# EAGLE board oresat-proto-card (EAGLE 9.6.2), part 1 of 2
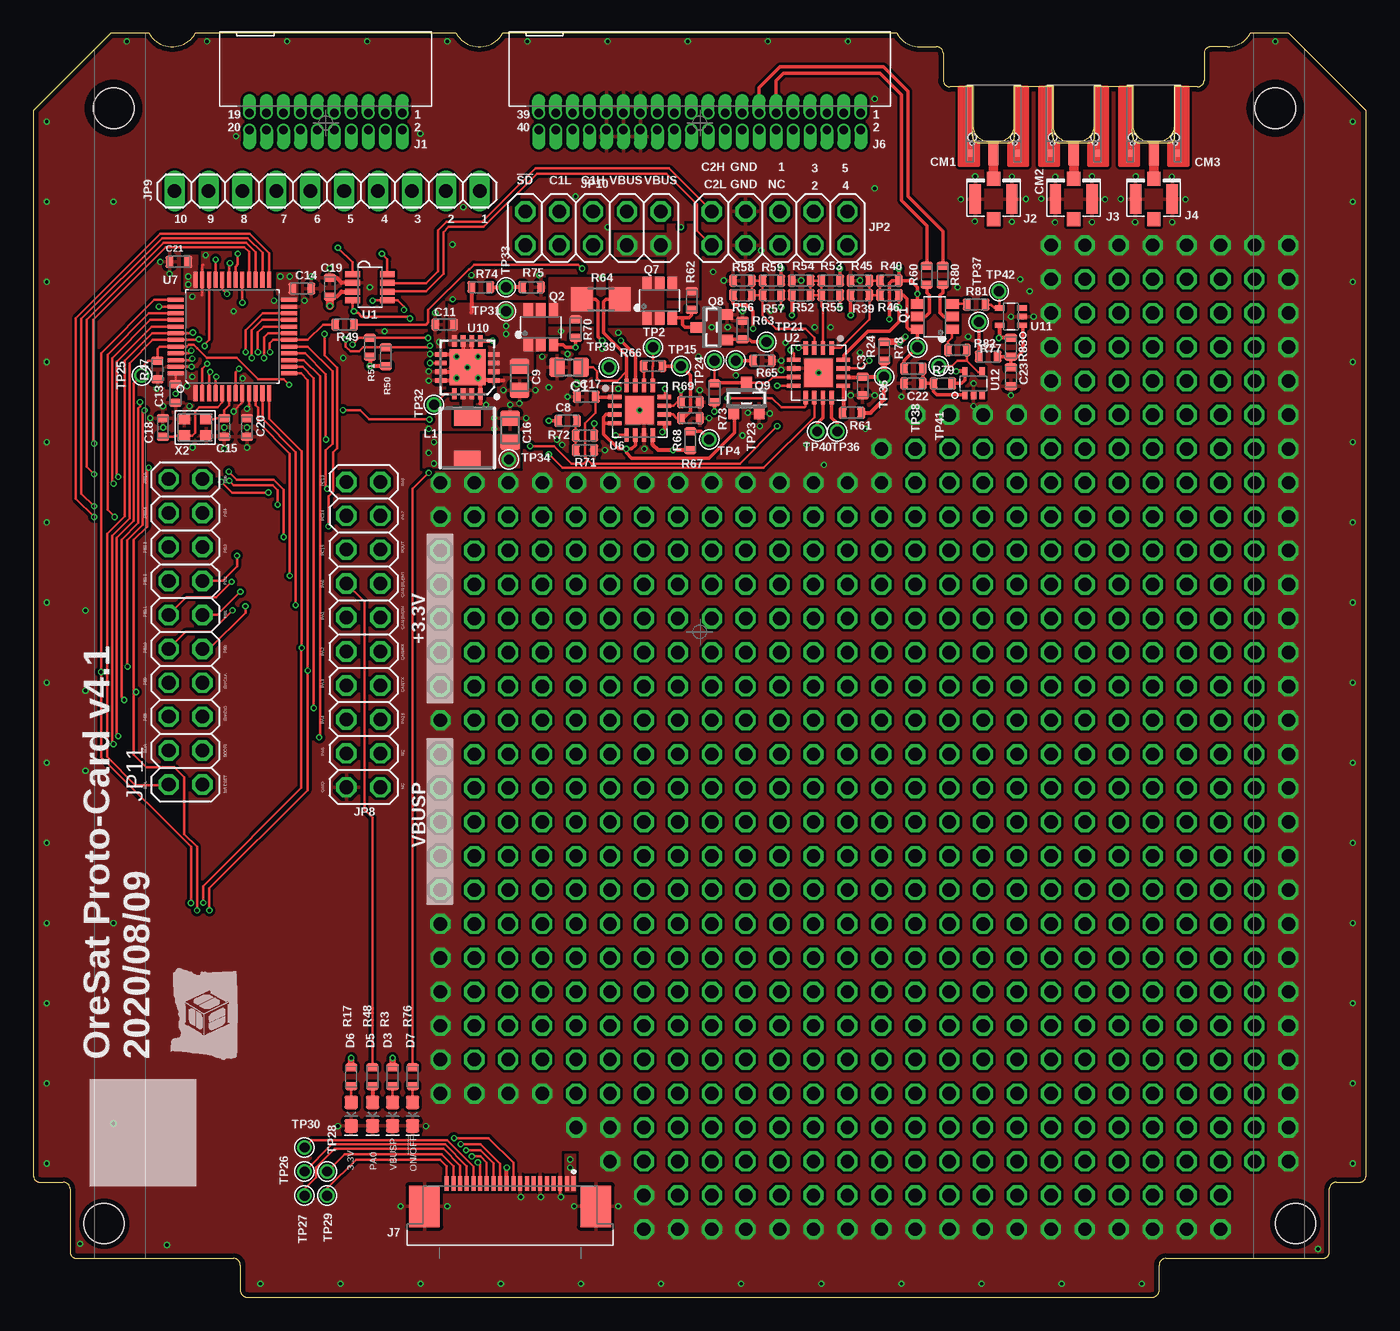
[diagram p3: board, top side]
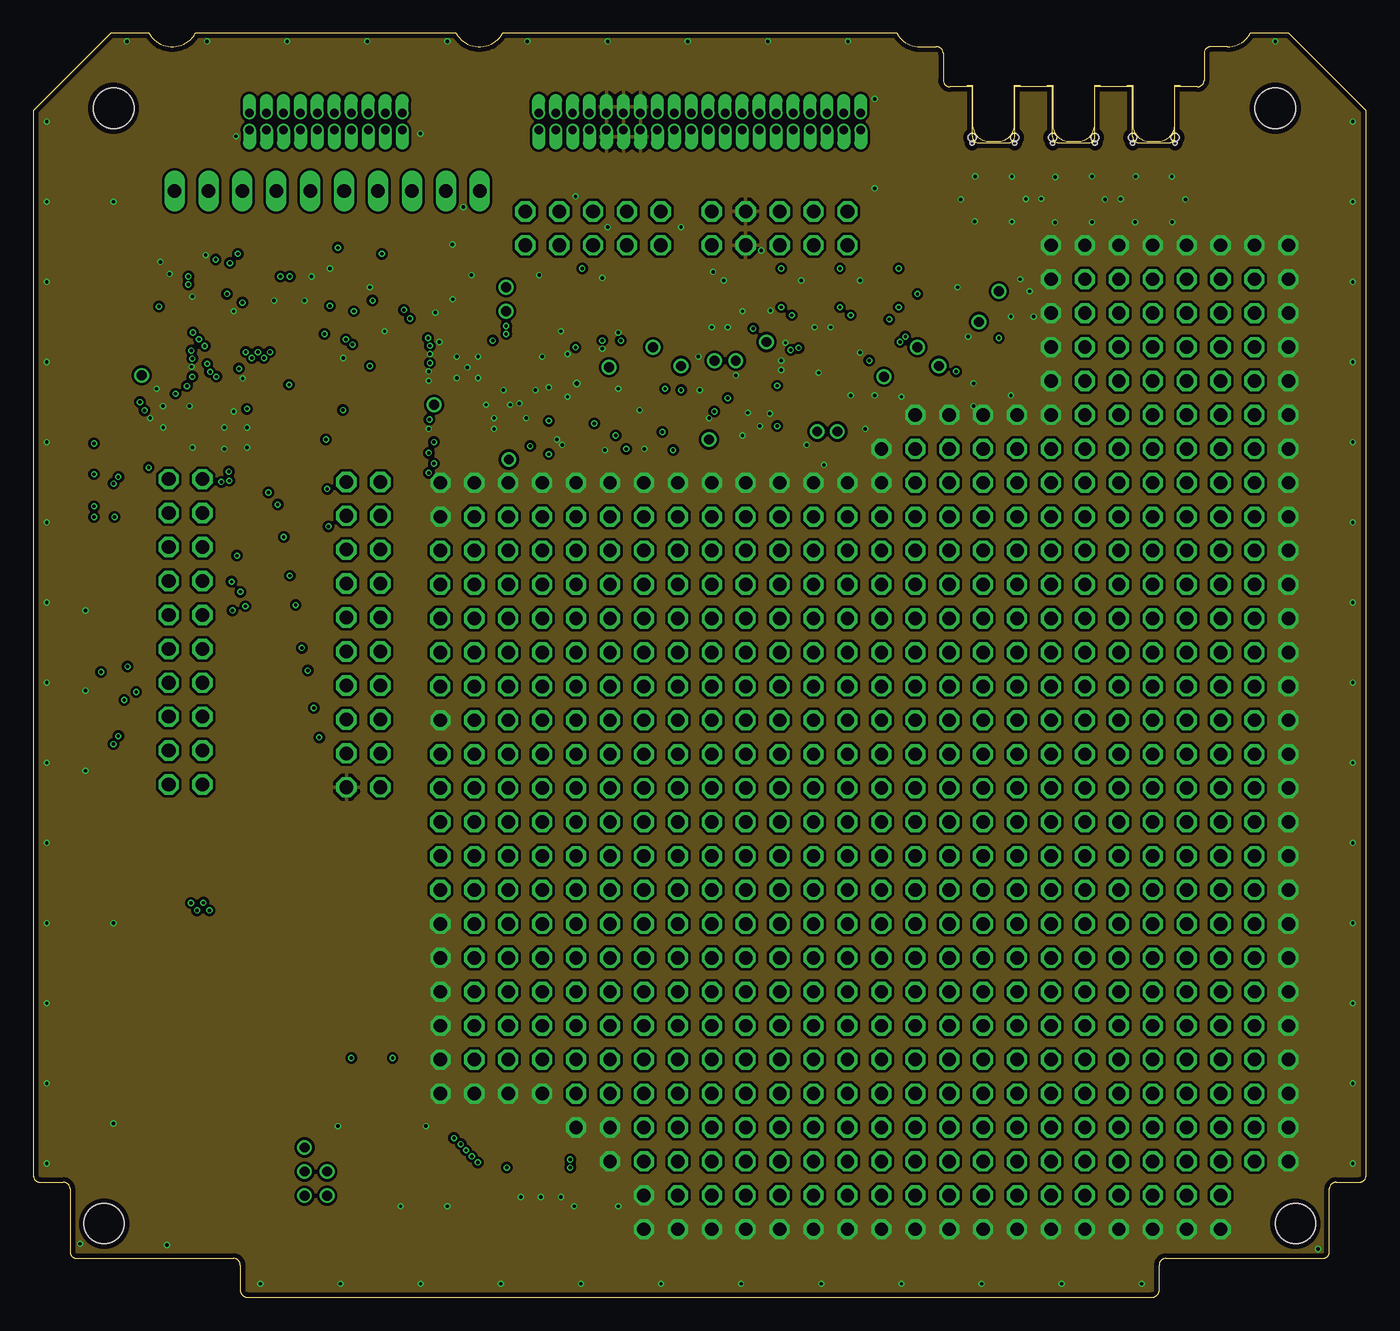
[diagram p4: board, inner layer Route2]
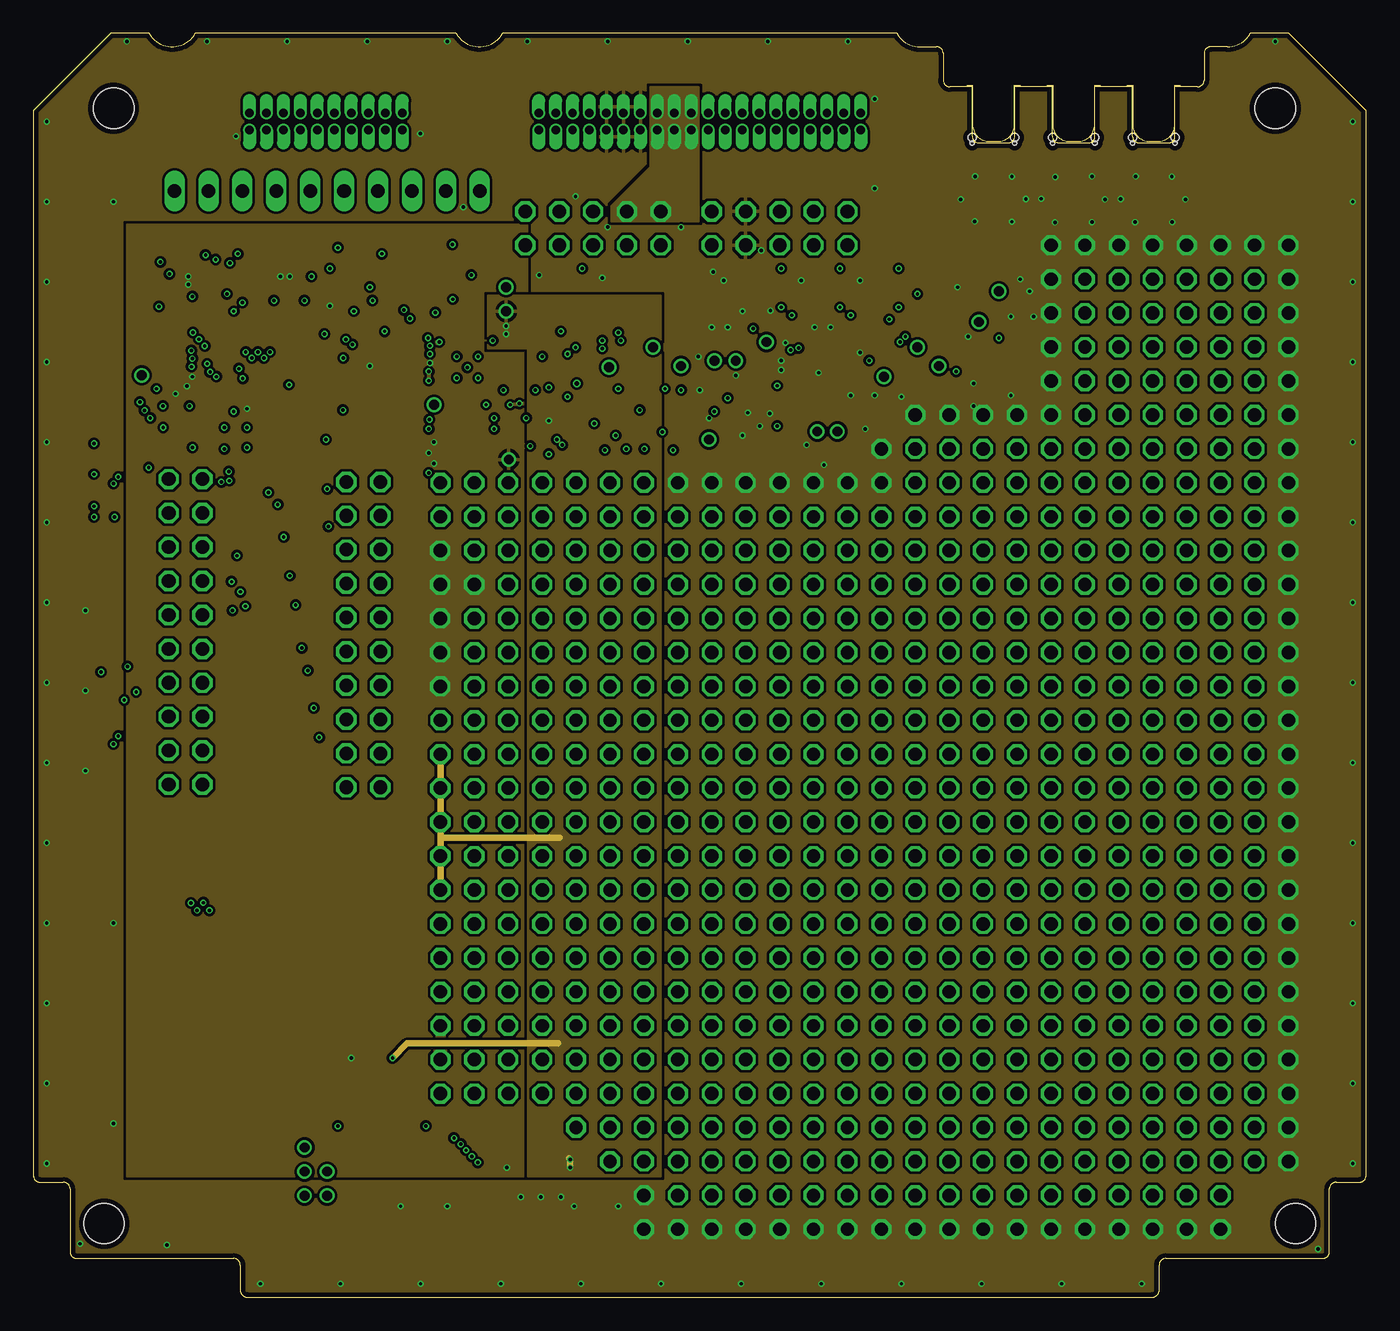
[diagram p5: board, inner layer route]
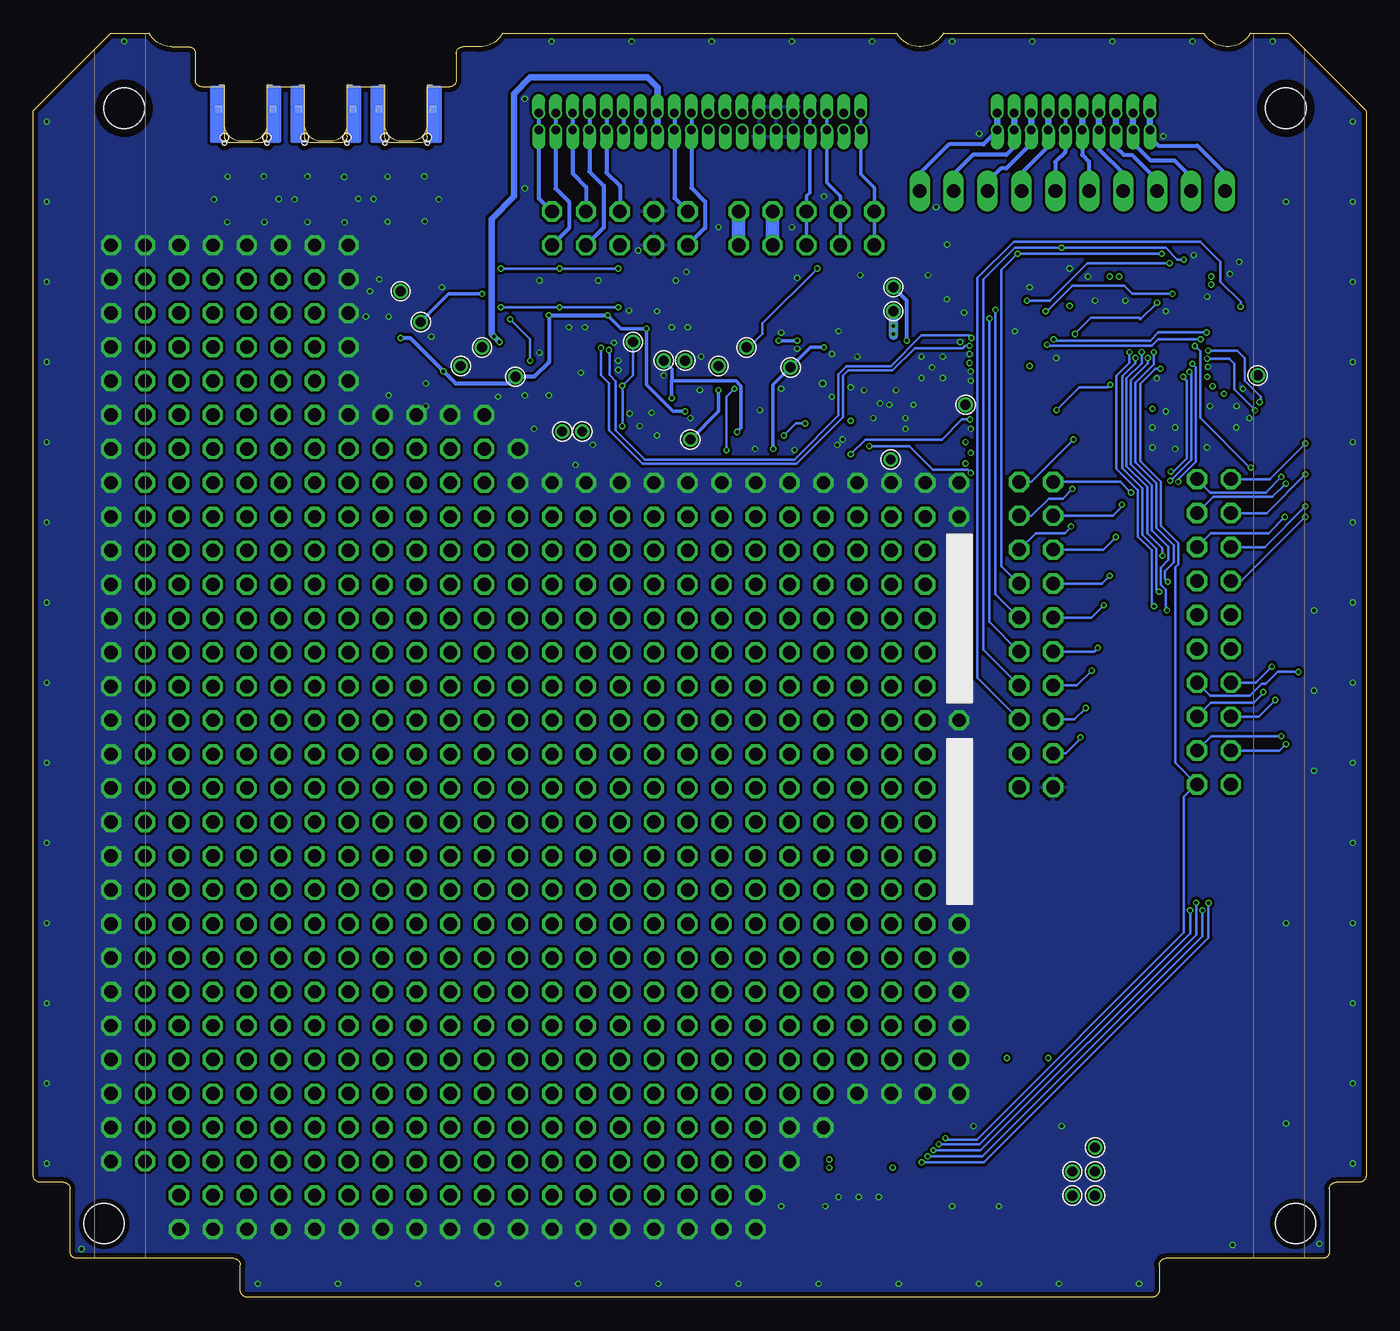
[diagram p6: board, bottom side, seen from below]

Size 99.8 x 94.6 mm. Coordinates in mm from the lower left corner, seen from the top.
Copper layers (1*2*15*16): Top 0.035559375mm / dielectric 0.17018125mm / Route2 0.01778125mm / dielectric 47mil / route 0.01778125mm / dielectric 0.17018125mm / Bottom 0.035559375mm
Design rules "oshpark4layer *": minimum track width 5mil, minimum drill 10mil, track to track 5mil, track to pad 5mil, pad to pad 5mil, via to via 5mil, smd to smd 5mil, copper to edge 15mil, drill to drill 6mil, minimum pad ring 4mil, minimum via ring 4mil, stop-mask expansion 2.5mil, vias tented up to drill 10mil, thermal gap 10mil

## Footprints (pad centres in the part's own frame; a part is rotated, then mirrored left to right if it is on the bottom)
.0805-B-NOSILK = smd 1.15 x 1.45: 1 -0.9,0; 2 0.9,0
.0603-C-NOSILK = smd 0.6 x 0.9: 1 -0.7,0; 2 0.7,0
J-MOLEX-SMPM-073300-003X = smd 0.508 x 0.508: P$1 -1.778,-5.08; P$2 1.778,-5.08 | smd 0.508 x 0.508 bottom: P$3 -2.032,-1.778; P$4 2.032,-1.778 | smd 0.762 x 1.778: RF 0,-5.08 | hole 0.61: 1.587,-3.886; -1.587,-3.886
LED-0603 = smd 1 x 1: A -0.877,0; C 0.877,0
STAND-OFF-TIGHT = hole 3.048: 0,0
J-SAMTEC-TFM-110-X1-XXX-D-RA = drill 0.635 pad 0.965 offset: 1 5.715,0.635; 2 5.715,-0.635; 3 4.445,0.635; 4 4.445,-0.635; 5 3.175,0.635; 6 3.175,-0.635; 7 1.905,0.635; 8 1.905,-0.635; 9 0.635,0.635; 10 0.635,-0.635; 11 -0.635,0.635; 12 -0.635,-0.635; 13 -1.905,0.635; 14 -1.905,-0.635; 15 -3.175,0.635; 16 -3.175,-0.635; 17 -4.445,0.635; 18 -4.445,-0.635; 19 -5.715,0.635; 20 -5.715,-0.635
U.FL = smd 2.2 x 0.85: 1 0,1.375; 2 0,-1.375 | smd 1.05 x 1: FEED 1.525,0; NC -1.525,0
J-SAMTEC-TFM-120-X1-XXX-D-RA = drill 0.635 pad 0.965 offset: 1 12.065,0.635; 2 12.065,-0.635; 3 10.795,0.635; 4 10.795,-0.635; 5 9.525,0.635; 6 9.525,-0.635; 7 8.255,0.635; 8 8.255,-0.635; 9 6.985,0.635; 10 6.985,-0.635; 11 5.715,0.635; 12 5.715,-0.635; 13 4.445,0.635; 14 4.445,-0.635; 15 3.175,0.635; 16 3.175,-0.635; 17 1.905,0.635; 18 1.905,-0.635; 19 0.635,0.635; 20 0.635,-0.635; 21 -0.635,0.635; 22 -0.635,-0.635; 23 -1.905,0.635; 24 -1.905,-0.635; 25 -3.175,0.635; 26 -3.175,-0.635; 27 -4.445,0.635; 28 -4.445,-0.635; 29 -5.715,0.635; 30 -5.715,-0.635; 31 -6.985,0.635; 32 -6.985,-0.635; 33 -8.255,0.635; 34 -8.255,-0.635; 35 -9.525,0.635; 36 -9.525,-0.635; 37 -10.795,0.635; 38 -10.795,-0.635; 39 -12.065,0.635; 40 -12.065,-0.635
TE_2-1734592-0 = smd 0.3 x 1.1: 1 -4.75,-1.7; 2 -4.25,-1.7; 3 -3.75,-1.7; 4 -3.25,-1.7; 5 -2.75,-1.7; 6 -2.25,-1.7; 7 -1.75,-1.7; 8 -1.25,-1.7; 9 -0.75,-1.7; 10 -0.25,-1.7; 11 0.25,-1.7; 12 0.75,-1.7; 13 1.25,-1.7; 14 1.75,-1.7; 15 2.25,-1.7; 16 2.75,-1.7; 17 3.25,-1.7; 18 3.75,-1.7; 19 4.25,-1.7; 20 4.75,-1.7 | smd 2.3 x 3.1: PAD1 6.42,0; PAD2 -6.42,0
2X05 = drill 1.016 octagon: 1 -5.08,-1.27; 2 -5.08,1.27; 3 -2.54,-1.27; 4 -2.54,1.27; 5 0,-1.27; 6 0,1.27; 7 2.54,-1.27; 8 2.54,1.27; 9 5.08,-1.27; 10 5.08,1.27
2X10 = drill 1.016 octagon: 1 -11.43,-1.27; 2 -11.43,1.27; 3 -8.89,-1.27; 4 -8.89,1.27; 5 -6.35,-1.27; 6 -6.35,1.27; 7 -3.81,-1.27; 8 -3.81,1.27; 9 -1.27,-1.27; 10 -1.27,1.27; 11 1.27,-1.27; 12 1.27,1.27; 13 3.81,-1.27; 14 3.81,1.27; 15 6.35,-1.27; 16 6.35,1.27; 17 8.89,-1.27; 18 8.89,1.27; 19 11.43,-1.27; 20 11.43,1.27
1X10 = drill 1.016 long: 1 -11.43,0; 2 -8.89,0; 3 -6.35,0; 4 -3.81,0; 5 -1.27,0; 6 1.27,0; 7 3.81,0; 8 6.35,0; 9 8.89,0; 10 11.43,0
ECS-MPI4040 = smd 2 x 1.3: 1 0,1.575; 2 0,-1.575
SOT23-6 = smd 0.7 x 1: 1 -0.95,-1.3; 2 0,-1.3; 3 0.95,-1.3; 4 0.95,1.3; 5 0,1.3; 6 -0.95,1.3
SOT23 = smd 0.787 x 0.889: 1 -0.953,-1.143; 2 0.953,-1.143; 3 0,1.143
R1206 = smd 1.6 x 1.803: 1 -1.422,0; 2 1.422,0
1X01 = drill 0.737 pad 1.1: 1 0,0
SOT23-8_TI-DCN = smd 0.45 x 1.1: 1 -0.975,-1.3; 2 -0.325,-1.3; 3 0.325,-1.3; 4 0.975,-1.3; 5 0.975,1.3; 6 0.325,1.3; 7 -0.325,1.3; 8 -0.975,1.3
QFN65P400X400X80-17T210 = smd 1.01 x 0.32: 1 -1.86,0.975; 2 -1.86,0.325; 3 -1.86,-0.325; 4 -1.86,-0.975; 9 1.86,-0.975; 10 1.86,-0.325; 11 1.86,0.325; 12 1.86,0.975 | smd 0.32 x 1.01: 5 -0.975,-1.86; 6 -0.325,-1.86; 7 0.325,-1.86; 8 0.975,-1.86; 13 0.975,1.86; 14 0.325,1.86; 15 -0.325,1.86; 16 -0.975,1.86 | smd 2.1 x 2.1: EPAD 0,0
STM32F091C = smd 0.3 x 1.2: 1 -2.75,-4.25; 2 -2.25,-4.25; 3 -1.75,-4.25; 4 -1.25,-4.25; 5 -0.75,-4.25; 6 -0.25,-4.25; 7 0.25,-4.25; 8 0.75,-4.25; 9 1.25,-4.25; 10 1.75,-4.25; 11 2.25,-4.25; 12 2.75,-4.25; 25 2.75,4.25; 26 2.25,4.25; 27 1.75,4.25; 28 1.25,4.25; 29 0.75,4.25; 30 0.25,4.25; 31 -0.25,4.25; 32 -0.75,4.25; 33 -1.25,4.25; 34 -1.75,4.25; 35 -2.25,4.25; 36 -2.75,4.25 | smd 1.2 x 0.3: 13 4.25,-2.75; 14 4.25,-2.25; 15 4.25,-1.75; 16 4.25,-1.25; 17 4.25,-0.75; 18 4.25,-0.25; 19 4.25,0.25; 20 4.25,0.75; 21 4.25,1.25; 22 4.25,1.75; 23 4.25,2.25; 24 4.25,2.75; 37 -4.25,2.75; 38 -4.25,2.25; 39 -4.25,1.75; 40 -4.25,1.25; 41 -4.25,0.75; 42 -4.25,0.25; 43 -4.25,-0.25; 44 -4.25,-0.75; 45 -4.25,-1.25; 46 -4.25,-1.75; 47 -4.25,-2.25; 48 -4.25,-2.75
S-PVQFN-16 = smd 0.85 x 0.35: 1 -1.975,0.975; 2 -1.975,0.325; 3 -1.975,-0.325; 4 -1.975,-0.975; 9 1.975,-0.975; 10 1.975,-0.325; 11 1.975,0.325; 12 1.975,0.975 | smd 0.35 x 0.85: 5 -0.975,-1.975; 6 -0.325,-1.975; 7 0.325,-1.975; 8 0.975,-1.975; 13 0.975,1.975; 14 0.325,1.975; 15 -0.325,1.975; 16 -0.975,1.975 | smd 2.7 x 2.7: PAD 0,0
SC70-5 = smd 0.4 x 0.7: 1 -0.65,-0.85; 2 0,-0.85; 3 0.65,-0.85; 4 0.65,0.85; 5 -0.65,0.85
ORESAT-CARD-V1.3-GENERIC-3RF = hole 0.32: 70.31,86.4; 73.49,86.4; 76.31,86.4; 79.49,86.4; 85.49,86.4; 82.31,86.4 | hole 3: 94.5,5.5; 5.3,5.5
CRYSTAL_2.5X2 = smd 0.9 x 0.8: 1 -0.825,-0.625; 2 0.825,-0.625; 3 0.825,0.625; 4 -0.825,0.625

## Placement (x,y rotation side)
C1  10u  [.0805-B-NOSILK]  40.1,69.6 180 top
C3  100n  [.0603-C-NOSILK]  62.1,68.2 90 top
C8  1u  [.0603-C-NOSILK]  40,65.6 180 top
C9  10u  [.0805-B-NOSILK]  36.4,68.8 270 top
C11  1u  [.0603-C-NOSILK]  30.8,72.8 180 top
C13  100n  [.0603-C-NOSILK]  10.65,67.64 90 top
C14  100n  [.0603-C-NOSILK]  20.1,75.5 180 top
C15  20p  [.0603-C-NOSILK]  14.3,65.1 270 top
C16  22u  [.0805-B-NOSILK]  35.7,64.9 90 top
C17  1u  [.0603-C-NOSILK]  41.4,67.4 180 top
C18  20p  [.0603-C-NOSILK]  9.7,65.1 90 top
C19  100n  [.0603-C-NOSILK]  22.2,75.6 270 top
C20  100n  [.0603-C-NOSILK]  16,65.1 90 top
C21  100n  [.0603-C-NOSILK]  10.9,77.5 0 top
C22  1u  [.0603-C-NOSILK]  65.9,68.4 180 top
C23  1u  [.0603-C-NOSILK]  73.2,68.9 270 top
CM1  J-MOLEX-SMPM-73300-003X  [J-MOLEX-SMPM-073300-003X]  71.9,90.7 0 top
CM2  J-MOLEX-SMPM-73300-003X  [J-MOLEX-SMPM-073300-003X]  77.9,90.7 0 top
CM3  J-MOLEX-SMPM-73300-003X  [J-MOLEX-SMPM-073300-003X]  83.9,90.7 0 top
D3  GREEN  [LED-0603]  26.9,13.7 270 top
D5  AMBER  [LED-0603]  25.4,13.7 270 top
D6  GREEN  [LED-0603]  23.8,13.7 270 top
D7  AMBER  [LED-0603]  28.4,13.7 270 top
H2  STAND-OFFTIGHT  [STAND-OFF-TIGHT]  93,89 0 top
H3  STAND-OFFTIGHT  [STAND-OFF-TIGHT]  6,89 0 top
J1  J-SAMTEC-TFM-110-X1-XXX-D-RA  [J-SAMTEC-TFM-110-X1-XXX-D-RA]  21.9,87.99 0 top
J2  U.FL  [U.FL]  71.9,82.2 90 top
J3  U.FL  [U.FL]  77.9,82.2 90 top
J4  U.FL  [U.FL]  83.9,82.2 90 top
J6  J-SAMTEC-TFM-120-X1-XXX-D-RA  [J-SAMTEC-TFM-120-X1-XXX-D-RA]  49.9,87.99 0 top
J7  ORESAT-DEBUG-CONNECTOR-ALL  [TE_2-1734592-0]  35.7,6.8 180 top
JP2  [2X05]  55.88,80.01 180 top
JP8  [2X10]  24.72,49.6 270 top
JP9  [1X10]  22,82.8 180 top
JP10  [2X05]  41.91,80.01 180 top
JP11  [2X10]  11.4,49.8 90 top
L1  6.8u  [ECS-MPI4040]  32.5,64.3 0 top
Q1  DMP2240UDM  [SOT23-6]  67.5,73.4 90 top
Q2  MOSFET-PCH-SOT23-6  [SOT23-6]  38,72.6 0 top
Q7  MOSFET-PCH-SOT23-6  [SOT23-6]  46.9,74.6 0 top
Q8  PMV45EN  [SOT23]  50.8,72.6 90 top
Q9  PMV45EN  [SOT23]  53.4,67.3 0 top
R3  2.7k  [.0603-C-NOSILK]  26.9,16.5 90 top
R17  2.7k  [.0603-C-NOSILK]  23.8,16.5 90 top
R24  10  [.0603-C-NOSILK]  63.7,70.8 270 top
R39  NP  [.0603-C-NOSILK]  61.9,75 180 top
R40  NP  [.0603-C-NOSILK]  64.1,76.1 180 top
R45  NP  [.0603-C-NOSILK]  61.9,76.1 0 top
R46  NP  [.0603-C-NOSILK]  64.1,75 0 top
R47  10k  [.0603-C-NOSILK]  9.3,69.4 90 top
R48  2.7k  [.0603-C-NOSILK]  25.4,16.5 90 top
R49  10k  [.0603-C-NOSILK]  23.3,72.8 180 top
R50  4.7k  [.0603-C-NOSILK]  26.4,70.4 270 top
R51  4.7k  [.0603-C-NOSILK]  25.2,71.1 270 top
R52  NP  [.0603-C-NOSILK]  57.5,75 180 top
R53  NP  [.0603-C-NOSILK]  59.7,76.1 180 top
R54  NP  [.0603-C-NOSILK]  57.5,76.1 0 top
R55  NP  [.0603-C-NOSILK]  59.7,75 0 top
R56  NP  [.0603-C-NOSILK]  53.1,75 180 top
R57  NP  [.0603-C-NOSILK]  55.3,76.1 180 top
R58  NP  [.0603-C-NOSILK]  53.1,76.1 0 top
R59  NP  [.0603-C-NOSILK]  55.3,75 0 top
R60  100  [.0603-C-NOSILK]  66.9,76.5 270 top
R61  10k  [.0603-C-NOSILK]  61.3,66.2 0 top
R62  10k  [.0603-C-NOSILK]  49.3,74.6 90 top
R63  10k  [.0603-C-NOSILK]  53.1,72.4 270 top
R64  100m  [R1206]  42.5,74.7 180 top
R65  10k  [.0603-C-NOSILK]  54.6,70.1 180 top
R66  0  [.0603-C-NOSILK]  46.4,69.7 180 top
R67  NP  [.0603-C-NOSILK]  49.2,65.8 180 top
R68  0  [.0603-C-NOSILK]  49.2,64.1 270 top
R69  NP  [.0603-C-NOSILK]  49.2,67 180 top
R70  10k  [.0603-C-NOSILK]  40.6,72.5 90 top
R71  100k  [.0603-C-NOSILK]  41.3,63.4 180 top
R72  10K  [.0603-C-NOSILK]  41.3,64.5 180 top
R73  10k  [.0603-C-NOSILK]  51,67.7 270 top
R74  10k  [.0603-C-NOSILK]  33.5,75.6 180 top
R75  NP  [.0603-C-NOSILK]  37.3,75.6 180 top
R76  2.7k  [.0603-C-NOSILK]  28.4,16.5 90 top
R77  665k  [.0603-C-NOSILK]  69.2,70.9 180 top
R78  330k  [.0603-C-NOSILK]  65.9,69.5 180 top
R79  1M  [.0603-C-NOSILK]  68.1,68.4 0 top
R80  100  [.0603-C-NOSILK]  68.1,76.5 270 top
R81  665k  [.0603-C-NOSILK]  70.6,74.3 180 top
R82  330k  [.0603-C-NOSILK]  71.5,70.4 180 top
R83  1M  [.0603-C-NOSILK]  73.2,71.1 90 top
TP2  TEST-POINT-LARGE-SQUARE  [1X01]  46.4,71.1 0 top
TP4  TEST-POINT-LARGE-SQUARE  [1X01]  50.6,64.2 0 top
TP15  TEST-POINT-LARGE-SQUARE  [1X01]  48.5,69.7 0 top
TP21  TEST-POINT-LARGE-SQUARE  [1X01]  54.9,71.5 90 top
TP23  TEST-POINT-LARGE-SQUARE  [1X01]  52.6,70.1 0 top
TP24  TEST-POINT-LARGE-SQUARE  [1X01]  51,70.1 0 top
TP25  TEST-POINT-LARGE-SQUARE  [1X01]  8.12,69 270 top
TP26  TEST-POINT-LARGE-SQUARE  [1X01]  20.3,9.4 0 top
TP27  TEST-POINT-LARGE-SQUARE  [1X01]  20.3,7.6 0 top
TP28  TEST-POINT-LARGE-SQUARE  [1X01]  22,9.4 0 top
TP29  TEST-POINT-LARGE-SQUARE  [1X01]  22,7.6 0 top
TP30  TEST-POINT-LARGE-SQUARE  [1X01]  20.3,11.2 0 top
TP31  TEST-POINT-LARGE-SQUARE  [1X01]  35.4,73.8 0 top
TP32  TEST-POINT-LARGE-SQUARE  [1X01]  30,66.8 180 top
TP33  TEST-POINT-LARGE-SQUARE  [1X01]  35.4,75.6 0 top
TP34  TEST-POINT-LARGE-SQUARE  [1X01]  35.6,62.7 180 top
TP35  TEST-POINT-LARGE-SQUARE  [1X01]  63.7,68.9 0 top
TP36  TEST-POINT-LARGE-SQUARE  [1X01]  60.2,64.8 0 top
TP37  TEST-POINT-LARGE-SQUARE  [1X01]  70.8,73 0 top
TP38  TEST-POINT-LARGE-SQUARE  [1X01]  66.2,71.1 0 top
TP39  TEST-POINT-LARGE-SQUARE  [1X01]  43.1,69.6 0 top
TP40  TEST-POINT-LARGE-SQUARE  [1X01]  58.7,64.8 0 top
TP41  TEST-POINT-LARGE-SQUARE  [1X01]  67.8,69.7 0 top
TP42  TEST-POINT-LARGE-SQUARE  [1X01]  72.3,75.3 0 top
U1  TCAN330  [SOT23-8_TI-DCN]  25.2,75.6 270 top
U2  MAX7310ATE  [QFN65P400X400X80-17T210]  58.8,69.2 270 top
U6  MAX4211FETE  [QFN65P400X400X80-17T210]  45.4,66.4 0 top
U7  STM32F091C  [STM32F091C]  14.9,71.9 0 top
U10  TPS62111RSA  [S-PVQFN-16]  32.5,69.6 180 top
U11  MIC842LYC5  [SC70-5]  73.2,73.4 90 top
U12  MIC842LYC5  [SC70-5]  70.4,68.4 0 top
U$1  [ORESAT-CARD-V1.3-GENERIC-3RF]  0,0 0 top
X2  16MHZ-2.5x2mm  [CRYSTAL_2.5X2]  12.1,65.1 0 top